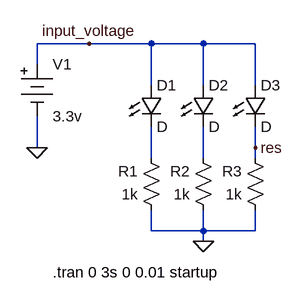
[diagram p0: schematic LED Circuit.asc]
LED Circuit.asc, the LTspice schematic file:
Version 4
SHEET 1 880 680
WIRE 208 208 128 208
WIRE 304 208 208 208
WIRE 384 208 304 208
WIRE 464 208 384 208
WIRE 128 240 128 208
WIRE 304 272 304 208
WIRE 384 272 384 208
WIRE 464 272 464 208
WIRE 128 368 128 320
WIRE 464 368 464 336
WIRE 304 384 304 336
WIRE 384 384 384 336
WIRE 464 384 464 368
WIRE 304 496 304 464
WIRE 384 496 384 464
WIRE 384 496 304 496
WIRE 464 496 464 464
WIRE 464 496 384 496
WIRE 384 512 384 496
FLAG 384 512 0
FLAG 128 368 0
FLAG 208 208 input_voltage
FLAG 464 368 res
SYMBOL res 320 480 R180
WINDOW 0 36 76 Left 2
WINDOW 3 36 40 Left 2
SYMATTR InstName R1
SYMATTR Value 1k
SYMBOL res 400 480 R180
WINDOW 0 36 76 Left 2
WINDOW 3 36 40 Left 2
SYMATTR InstName R2
SYMATTR Value 1k
SYMBOL res 480 480 R180
WINDOW 0 36 76 Left 2
WINDOW 3 36 40 Left 2
SYMATTR InstName R3
SYMATTR Value 1k
SYMBOL LED 288 272 R0
SYMATTR InstName D1
SYMBOL LED 368 272 R0
SYMATTR InstName D2
SYMBOL LED 448 272 R0
SYMATTR InstName D3
SYMBOL Misc/battery 128 224 R0
SYMATTR InstName V1
SYMATTR Value 3.3v
TEXT 152 560 Left 2 !.tran 0 3s 0 0.01 startup

The netlist it stands for:
* LED Circuit.asc
R1 0 N001 1k
R2 0 N002 1k
R3 0 res 1k
D1 input_voltage N001 D
D2 input_voltage N002 D
D3 input_voltage res D
V1 input_voltage 0 3.3v
.model D D
.lib standard.dio
.tran 0 3s 0 0.01 startup
.backanno
.end